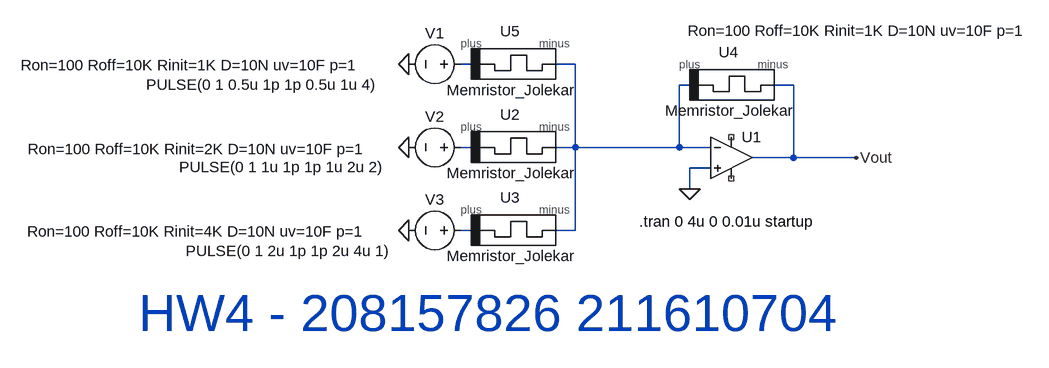
[diagram p0: schematic Q2_part_c.asc]
Q2_part_c.asc, the LTspice schematic file:
Version 4
SHEET 1 880 680
WIRE -64 64 -80 64
WIRE 96 64 64 64
WIRE 272 96 256 96
WIRE 432 96 400 96
WIRE -64 192 -80 192
WIRE 96 192 96 64
WIRE 96 192 64 192
WIRE 256 192 256 96
WIRE 256 192 96 192
WIRE 304 192 256 192
WIRE 432 208 432 96
WIRE 432 208 368 208
WIRE 528 208 432 208
WIRE 304 224 272 224
WIRE 272 256 272 224
WIRE -64 320 -80 320
WIRE 96 320 96 192
WIRE 96 320 64 320
FLAG -160 64 0
FLAG -160 192 0
FLAG -160 320 0
FLAG 272 256 0
FLAG 528 208 Vout
SYMBOL OpAmps\\UniversalOpAmp 336 208 R0
SYMATTR InstName U1
SYMBOL voltage -64 64 R90
WINDOW 0 -32 56 VBottom 2
WINDOW 3 16 321 VTop 2
WINDOW 123 0 0 Left 0
WINDOW 39 0 0 Left 0
SYMATTR InstName V1
SYMATTR Value PULSE(0 1 0.5u 1p 1p 0.5u 1u 4)
SYMBOL voltage -64 192 R90
WINDOW 0 -32 56 VBottom 2
WINDOW 3 15 291 VTop 2
SYMATTR InstName V2
SYMATTR Value PULSE(0 1 1u 1p 1p 1u 2u 2)
SYMBOL voltage -64 320 R90
WINDOW 0 -32 56 VBottom 2
WINDOW 3 16 281 VTop 2
SYMATTR InstName V3
SYMATTR Value PULSE(0 1 2u 1p 1p 2u 4u 1)
SYMBOL Jolekar 0 64 R0
WINDOW 39 -495 -14 Top 2
SYMATTR InstName U5
SYMATTR SpiceLine Ron=100 Roff=10K Rinit=1K D=10N uv=10F p=1
SYMBOL Jolekar 0 192 R0
WINDOW 39 -484 -13 Top 2
SYMATTR InstName U2
SYMATTR SpiceLine Ron=100 Roff=10K Rinit=2K D=10N uv=10F p=1
SYMBOL Jolekar 0 320 R0
WINDOW 39 -485 -14 Top 2
SYMATTR InstName U3
SYMATTR SpiceLine Ron=100 Roff=10K Rinit=4K D=10N uv=10F p=1
SYMBOL Jolekar 336 96 R0
WINDOW 39 195 -99 Top 2
SYMATTR InstName U4
SYMATTR SpiceLine Ron=100 Roff=10K Rinit=1K D=10N uv=10F p=1
TEXT 194 306 Left 2 !.tran 0 4u 0 0.01u startup
TEXT -576 448 Left 6 ;HW4 - 208157826 211610704

The netlist it stands for:
* Q2_part_c.asc
XU1 0 N002 NC_01 NC_02 Vout level1 Avol=1Meg GBW=10Meg Vos=0 En=0 Enk=0 In=0 Ink=0 Rin=500Meg  ; pins In+ In- V+ V- OUT
V1 N001 0 PULSE(0 1 0.5u 1p 1p 0.5u 1u 4)
V2 N003 0 PULSE(0 1 1u 1p 1p 1u 2u 2)
V3 N004 0 PULSE(0 1 2u 1p 1p 2u 4u 1)
XU5 N001 N002 Memristor_Jolekar Ron=100 Roff=10K Rinit=1K D=10N uv=10F p=1  ; pins plus minus
XU2 N003 N002 Memristor_Jolekar Ron=100 Roff=10K Rinit=2K D=10N uv=10F p=1  ; pins plus minus
XU3 N004 N002 Memristor_Jolekar Ron=100 Roff=10K Rinit=4K D=10N uv=10F p=1  ; pins plus minus
XU4 N002 Vout Memristor_Jolekar Ron=100 Roff=10K Rinit=1K D=10N uv=10F p=1  ; pins plus minus
.tran 0 4u 0 0.01u startup
* HW4 - 208157826 211610704
.lib UniversalOpAmp1.lib
.lib Jolekar.lib
.backanno
.end